# Altium schematic sheet STM32F407VGT6.SchDoc
size A; PageSetup: Record=PageOptions|CenterHorizontal=True|CenterVertical=True|PrintScale=1.12|XCorrection=1.00|YCorrection=1.00|PrintKind=0|BorderSize=5000000|LeftOffset=0|BottomOffset=0|Orientation=2|PaperLength=1000|PaperWidth=1000|Scale=100|PaperSource=7|PrintQuality=-3|MediaType=1|DitherType=10|PrintScaleMode=1|PaperKind=Letter|PaperIndex=1
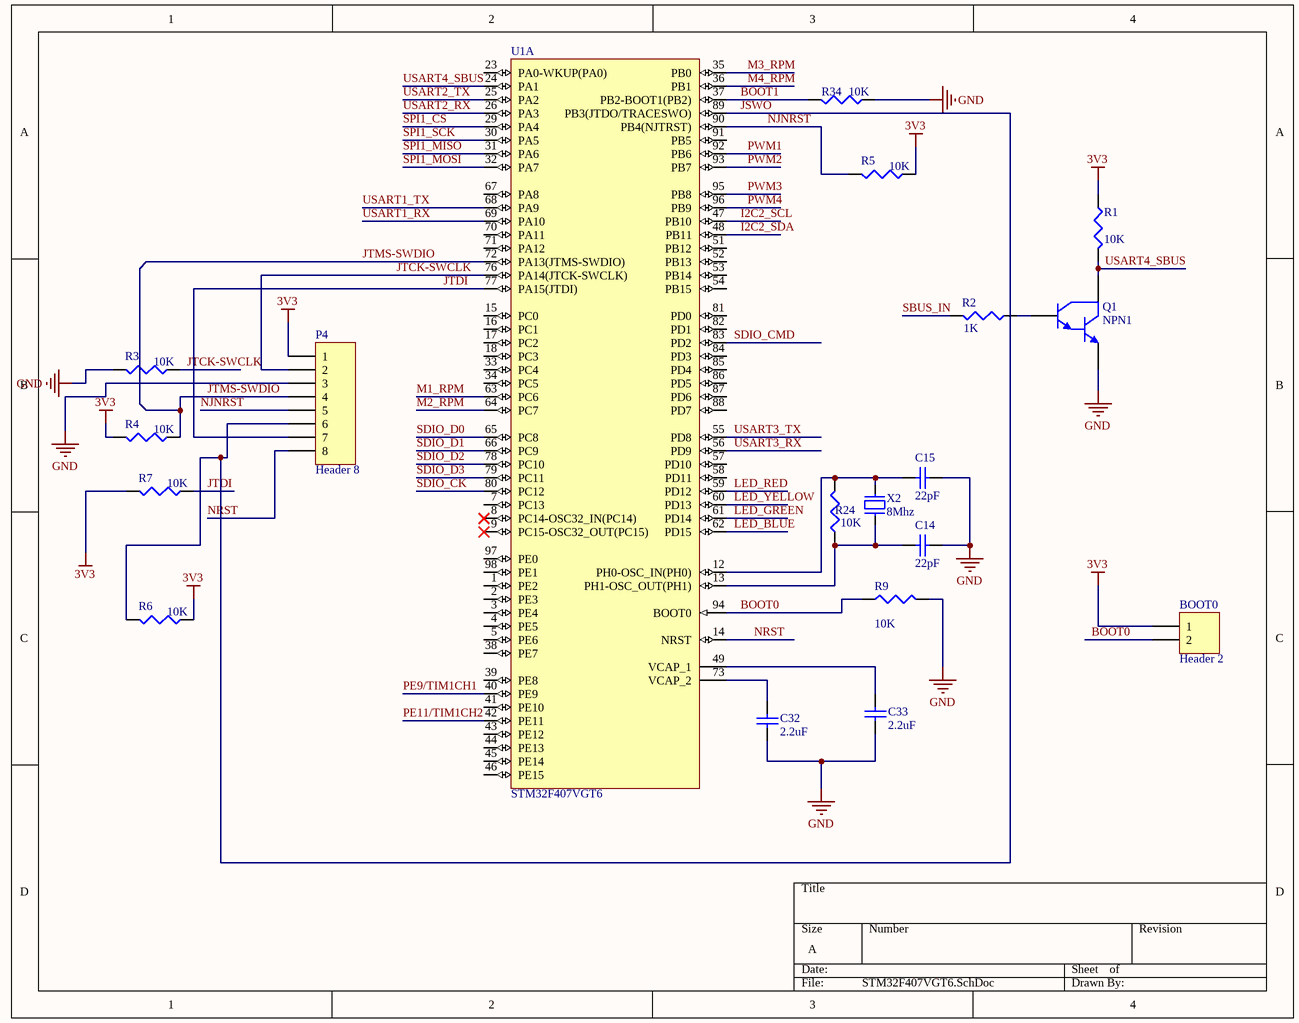
[diagram p0: STM32F407VGT6.SchDoc]

## Parts
BOOT0  Header 2  [HDR1X2]
C14  22pF  [CAPC1608X95N]
C15  22pF  [CAPC1608X95N]
C32  2.2uF  [CAPC3216X125N]
C33  2.2uF  [CAPC3216X125N]
P4  Header 8  [HDR1X8]
Q1  NPN1  [TO-92]
R1  value 10K  [RESC2012X60N]
R2  1K  [RESC2012X60N]
R3  value 10K  [RESC2012X60N]
R4  value 10K  [RESC2012X60N]
R5  value 10K  [RESC2012X60N]
R6  value 10K  [RESC2012X60N]
R7  value 10K  [RESC2012X60N]
R9  value 10K  [RESC2012X60N]
R24  value 10K  [RESC2012X60N]
R34  value 10K  [RESC2012X60N]
U1  STM32F407VGT6  [STM-LQFP100_N]  (part A of 2)
X2  8Mhz  [XT2]

## Nets
3V3: BOOT0.1 P4.1 R1.1 R4.2 R5.1 R6.1 R7.2
GND: C14.2 C15.2 C32.1 C33.1 P4.3 Q1.3(E) R3.2 R9.2 R34.1
BOOT0: BOOT0.2 R9.1 U1.94(BOOT0)
BOOT1: R34.2 U1.37(PB2-BOOT1(PB2))
I2C2_SCL: U1.47(PB10)
I2C2_SDA: U1.48(PB11)
JSWO: P4.6 R6.2 U1.89(PB3(JTDO/TRACESWO))
JTCK-SWCLK: P4.2 R3.1 U1.76(PA14(JTCK-SWCLK))
JTDI: P4.7 R7.1 U1.77(PA15(JTDI))
JTMS-SWDIO: P4.4 R4.1 U1.72(PA13(JTMS-SWDIO))
LED_BLUE: U1.62(PD15)
LED_GREEN: U1.61(PD14)
LED_RED: U1.59(PD12)
LED_YELLOW: U1.60(PD13)
M1_RPM: U1.63(PC6)
M2_RPM: U1.64(PC7)
M3_RPM: U1.35(PB0)
M4_RPM: U1.36(PB1)
NJNRST: P4.5 R5.2 U1.90(PB4(NJTRST))
NRST: P4.8 U1.14(NRST)
PE9/TIM1CH1: U1.40(PE9)
PE11/TIM1CH2: U1.42(PE11)
PWM1: U1.92(PB6)
PWM2: U1.93(PB7)
PWM3: U1.95(PB8)
PWM4: U1.96(PB9)
SBUS_IN: R2.2
SDIO_CK: U1.80(PC12)
SDIO_CMD: U1.83(PD2)
SDIO_D0: U1.65(PC8)
SDIO_D1: U1.66(PC9)
SDIO_D2: U1.78(PC10)
SDIO_D3: U1.79(PC11)
SPI1_CS: U1.29(PA4)
SPI1_MISO: U1.31(PA6)
SPI1_MOSI: U1.32(PA7)
SPI1_SCK: U1.30(PA5)
USART1_RX: U1.69(PA10)
USART1_TX: U1.68(PA9)
USART2_RX: U1.26(PA3)
USART2_TX: U1.25(PA2)
USART3_RX: U1.56(PD9)
USART3_TX: U1.55(PD8)
USART4_SBUS: Q1.1(C) R1.2 U1.24(PA1)
NetC14_1: C14.1 R24.1 U1.13(PH1-OSC_OUT(PH1)) X2.2
NetC15_1: C15.1 R24.2 U1.12(PH0-OSC_IN(PH0)) X2.1
NetC32_2: C32.2 U1.73(VCAP_2)
NetC33_2: C33.2 U1.49(VCAP_1)
NetQ1_2: Q1.2(B) R2.1

Not connected (* = marked no-connect by the designer): U1 1(PE2) 2(PE3) 3(PE4) 4(PE5) 5(PE6) 7(PC13) 8(PC14-OSC32_IN(PC14))* 9(PC15-OSC32_OUT(PC15))* 15(PC0) 16(PC1) 17(PC2) 18(PC3) 23(PA0-WKUP(PA0)) 33(PC4) 34(PC5) 38(PE7) 39(PE8) 41(PE10) 43(PE12) 44(PE13) 45(PE14) 46(PE15) 51(PB12) 52(PB13) 53(PB14) 54(PB15) 57(PD10) 58(PD11) 67(PA8) 70(PA11) 71(PA12) 81(PD0) 82(PD1) 84(PD3) 85(PD4) 86(PD5) 87(PD6) 88(PD7) 91(PB5) 97(PE0) 98(PE1)

## Library data of the parts
BOOT0 = Header 2: Header, 2-Pin; LatestRevisionDate: 17-Jul-2002; LatestRevisionNote: Re-released for DXP Platform.; Publisher: Altium Limited
C14 C15 C32 C33 = Cap Semi: Capacitor (Semiconductor SIM Model); Value: 104; LatestRevisionDate: 17-Jul-2002; LatestRevisionNote: Re-released for DXP Platform.; PackageReference: C1206; Publisher: Altium Limited
P4 = Header 8: Header, 8-Pin; LatestRevisionDate: 17-Jul-2002; LatestRevisionNote: Re-released for DXP Platform.; Publisher: Altium Limited
Q1 = NPN1: NPN Darlington Bipolar Transistor; Published: 8-Jun-2000; LatestRevisionDate: 17-Jul-2002; LatestRevisionNote: Re-released for DXP Platform.; DatasheetVersion: 1989; PackageVersion: 1989; PackageReference: TO-92; Publisher: Altium Limited; PackageDescription: TO, Flat Index; 3 In-Line, Axial Leads; Body Dia. 4.6mm; Leads 0.41 x 0.39 mm (max); Code_JEDEC: TO-92
R1-R7 R9 R24 R34 = Res3: Resistor; Published: 8-Jun-2000; LatestRevisionDate: 29-May-2009; LatestRevisionNote: IPC-7351 Footprint Added.; PackageReference: J1-0603; Publisher: Altium Limited; PackageDescription: Chip Resistor
  R2: Value: 1K
U1 = STM32F407VGT6: ARM Cortex-M4 32-bit MCU+FPU, 210 DMIPS, 1024 kB Flash, 192 kB Internal RAM, 82 I/Os, 100-pin LQFP, -40 to 85 degC, Tray; Manufacturer: STMicroelectronics; D/A Converter: 2x12-bit; FLASH Size (Prog) (kB): 1024; I/Os (High Current): 82; Internal RAM Size (kB): 192; Operating Frequency(F) (Processor speed) (MHz): 168; Supply Voltage(Vcc) max (V): 3.6; Supply Voltage(Vcc) min (V): 1.8; DatasheetVersion: Rev. 4; PackageVersion: Rev. 1, 06/2013; PackageReference: LQFP100; PackageDescription: 100-Pin Low Profile Quad Flat Package, 14 x 14 mm Body, 0.5 mm Pitch; Supplier 1: Digi-Key; Supplier Part Number 1: 497-11605-ND; Supplier 2: Farnell; Supplier Part Number 2: 2064368; Supplier 3: Newark; Supplier Part Number 3: 73T2333; Supplier 4: Mouser; Supplier Part Number 4: 511-STM32F407VGT6; Core: ARM Cortex-M4; Packing: Tray; Mounting Technology: Surface Mount; PartNumber: STM32F407VGT6; ComponentLink1Description: Manufacturer URL; ComponentLink1URL: http://www.st.com/web/en/home.html; ComponentLink2Description: Datasheet; ComponentLink2URL: http://www.st.com/st-web-ui/static/active/en/resource/technical/document/datasheet/DM00037051.pdf; ComponentLink3Description: Package Specification; ComponentLink3URL: http://www.st.com/st-web-ui/static/active/en/resource/technical/document/data_brief/DM00071938.pdf
X2 = XT2: Crystal For all Crystal 2pin.; Value: 4Mhz